# EasyEDA schematic Schem task 10.1.json
TITLE: Sheet_1; REV: 1.0; Date: 2020-05-30; Sheet: 1/1; Drawn By: nasi33; Company: Your Company
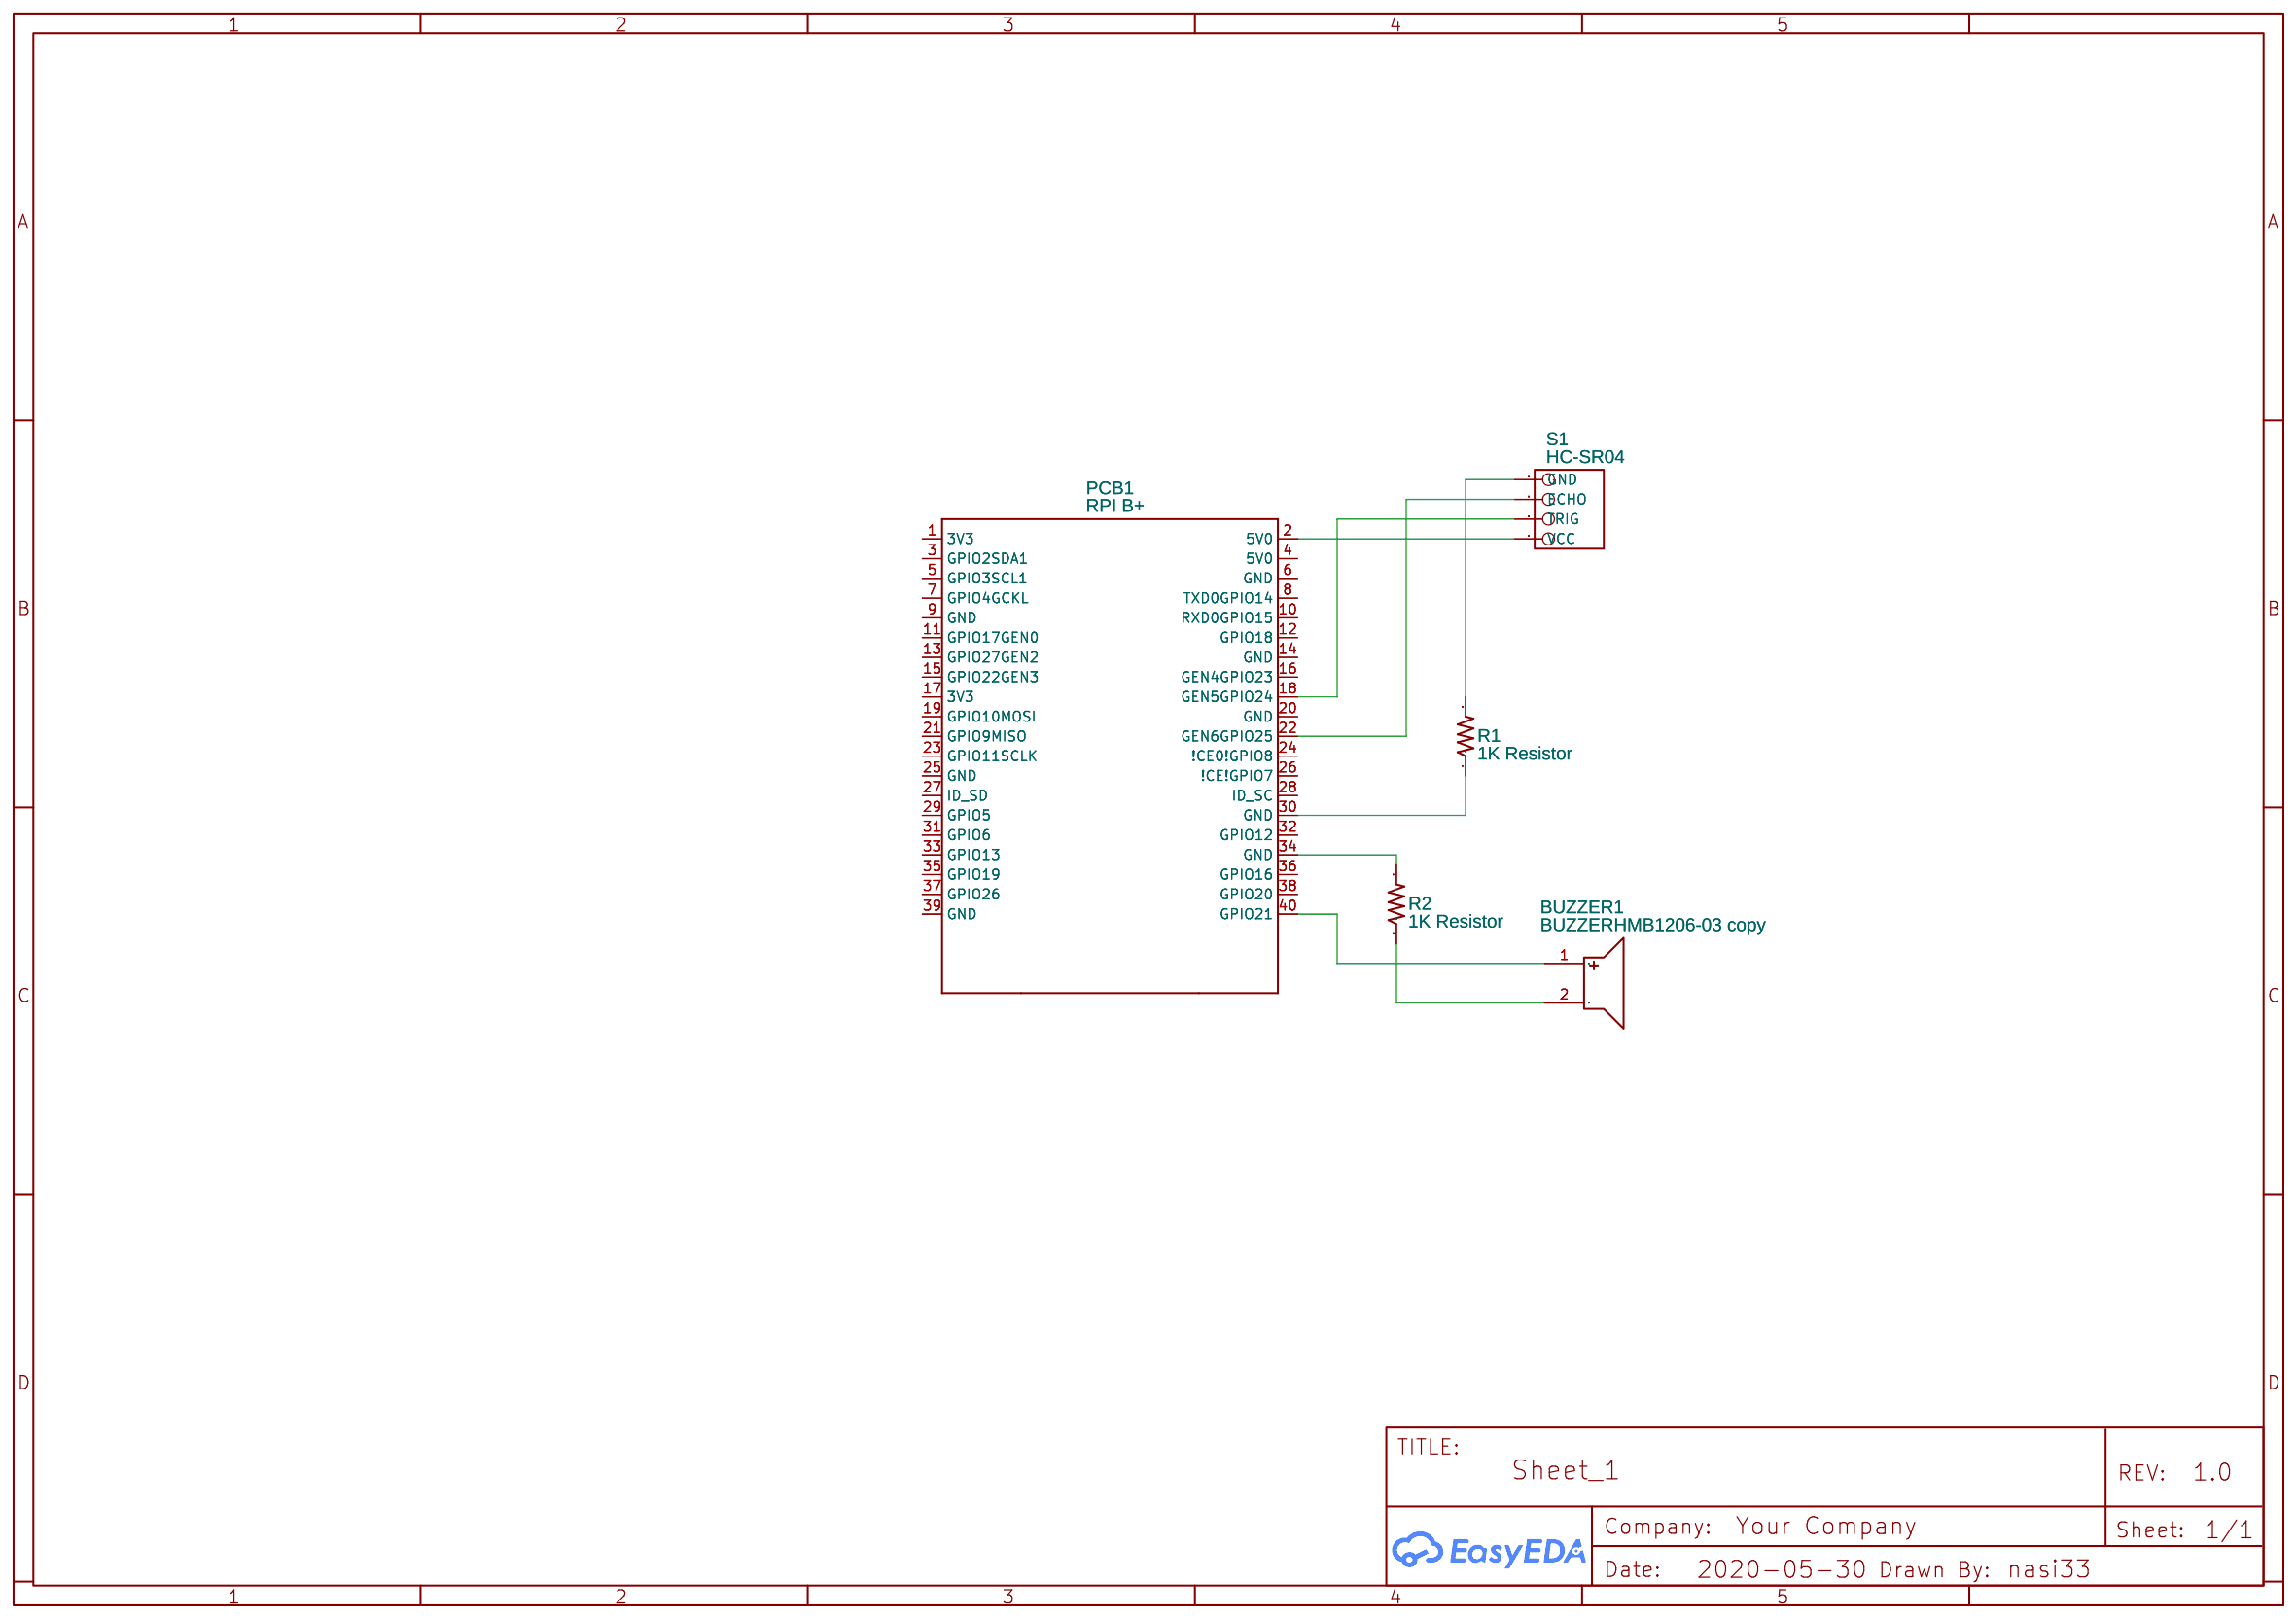
[diagram p0: schematic sheet]

## Parts
BUZZER1  BUZZERHMB1206-03 copy  [DIP-BUZZER-12X6]
PCB1  RPI B+  [RPI B+]
R1  1K Resistor  [1KOHM RESISTOR]
R2  1K Resistor  [1KOHM RESISTOR]
S1  HC-SR04  [HC-SR04]

## Library data of the parts
BUZZER1 = BUZZERHMB1206-03 copy: Supplier: LCSC; Manufacturer: HNDZ; Manufacturer Part: BUZZERHMB1206-03; Contributor: LCSC; Supplier Part: C96101
PCB1 = RPI B+: Raspberry Pi B+
R1 R2 = 1K Resistor: Contributor: uniqengineeringworks
S1 = HC-SR04: Contributor: gomezramones

## Nets
Net-(BUZZER1-1): BUZZER1.1 PCB1.40(GPIO21)
Net-(BUZZER1-2): BUZZER1.2 R2.1
Net-(PCB1-2): PCB1.2(5V0) S1.1(VCC)
Net-(PCB1-18): PCB1.18(GEN5GPIO24) S1.2(TRIG)
Net-(PCB1-22): PCB1.22(GEN6GPIO25) S1.3(ECHO)
Net-(PCB1-30): PCB1.30(GND) R1.1
Net-(PCB1-34): PCB1.34(GND) R2.2
Net-(R1-2): R1.2 S1.4(GND)

Not connected (* = marked no-connect by the designer): PCB1 1(3V3) 3(GPIO2SDA1) 4(5V0) 5(GPIO3SCL1) 6(GND) 7(GPIO4GCKL) 8(TXD0GPIO14) 9(GND) 10(RXD0GPIO15) 11(GPIO17GEN0) 12(GPIO18) 13(GPIO27GEN2) 14(GND) 15(GPIO22GEN3) 16(GEN4GPIO23) 17(3V3) 19(GPIO10MOSI) 20(GND) 21(GPIO9MISO) 23(GPIO11SCLK) 24(!CE0!GPIO8) 25(GND) 26(!CE!GPIO7) 27(ID_SD) 28(ID_SC) 29(GPIO5) 31(GPIO6) 32(GPIO12) 33(GPIO13) 35(GPIO19) 36(GPIO16) 37(GPIO26) 38(GPIO20) 39(GND)
